# EAGLE board 56 ch sample-and-hold card v1.0 (EAGLE 9.6.2)
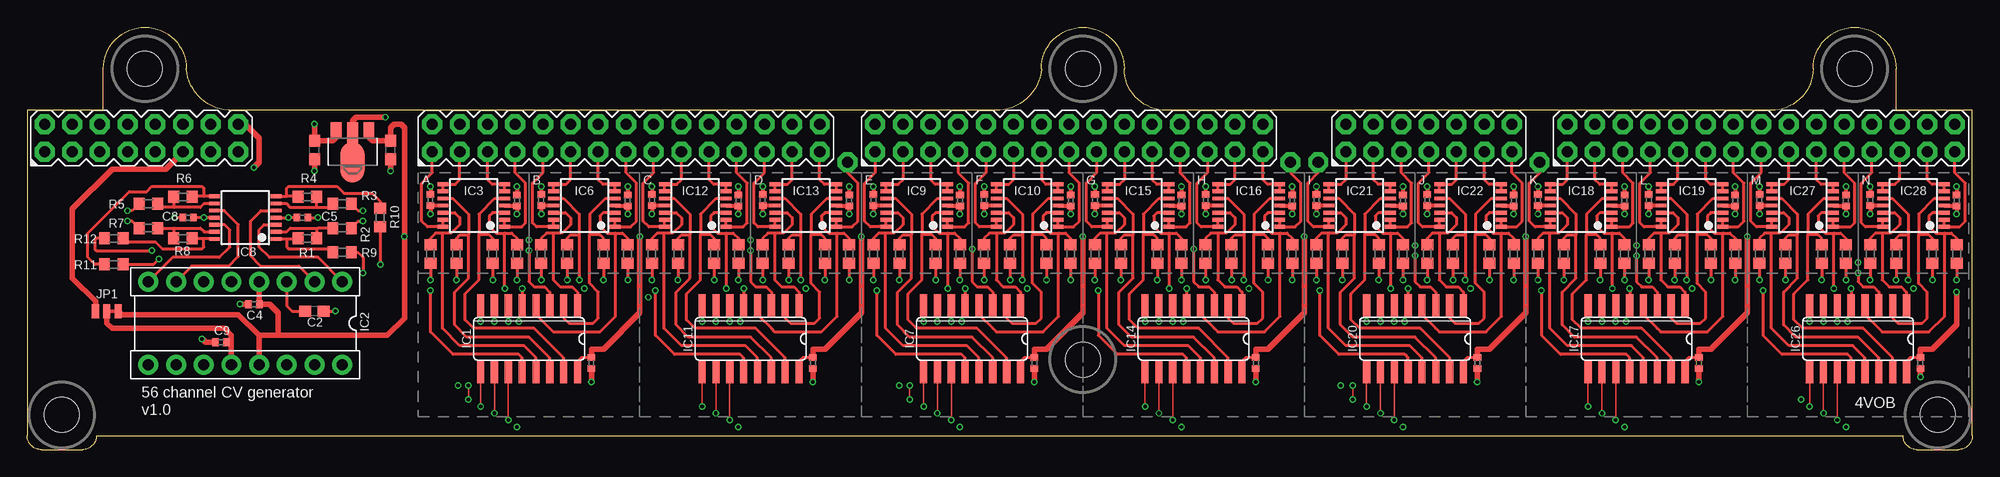
[diagram p3: board, top side]
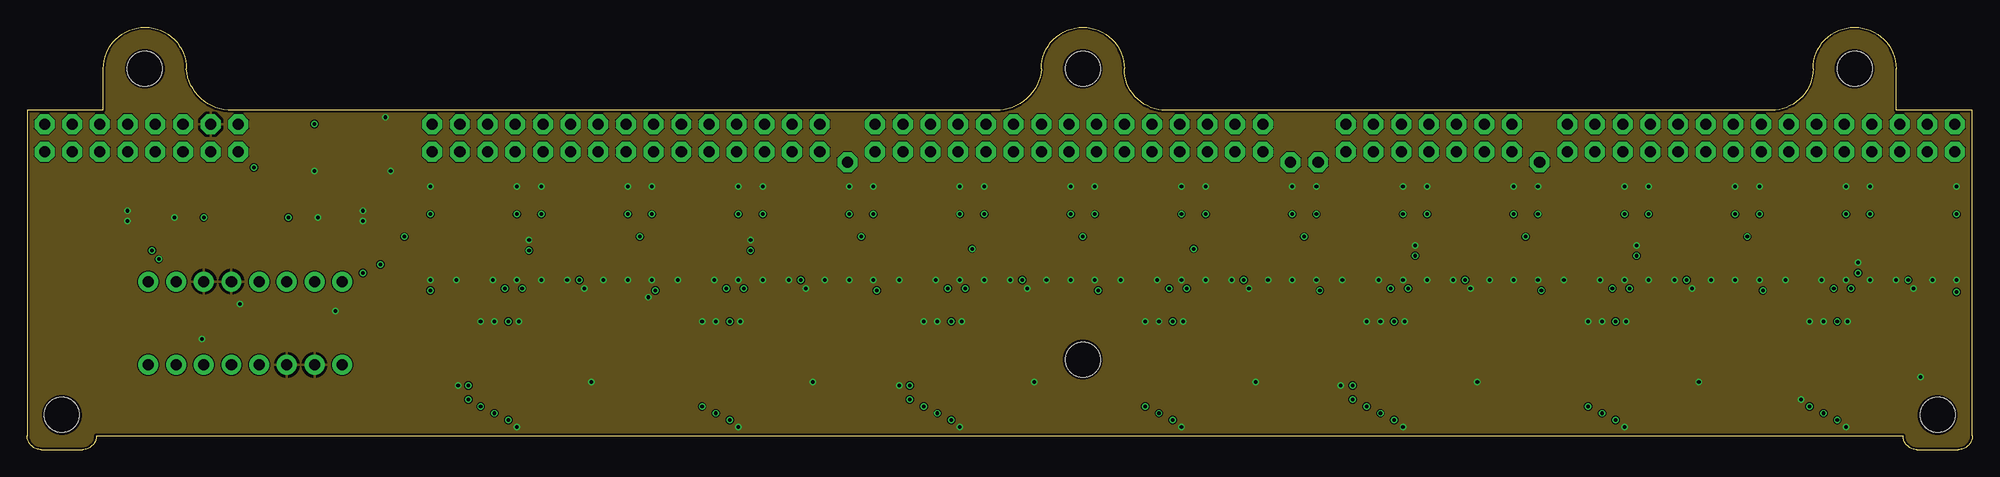
[diagram p4: board, inner layer Route2]
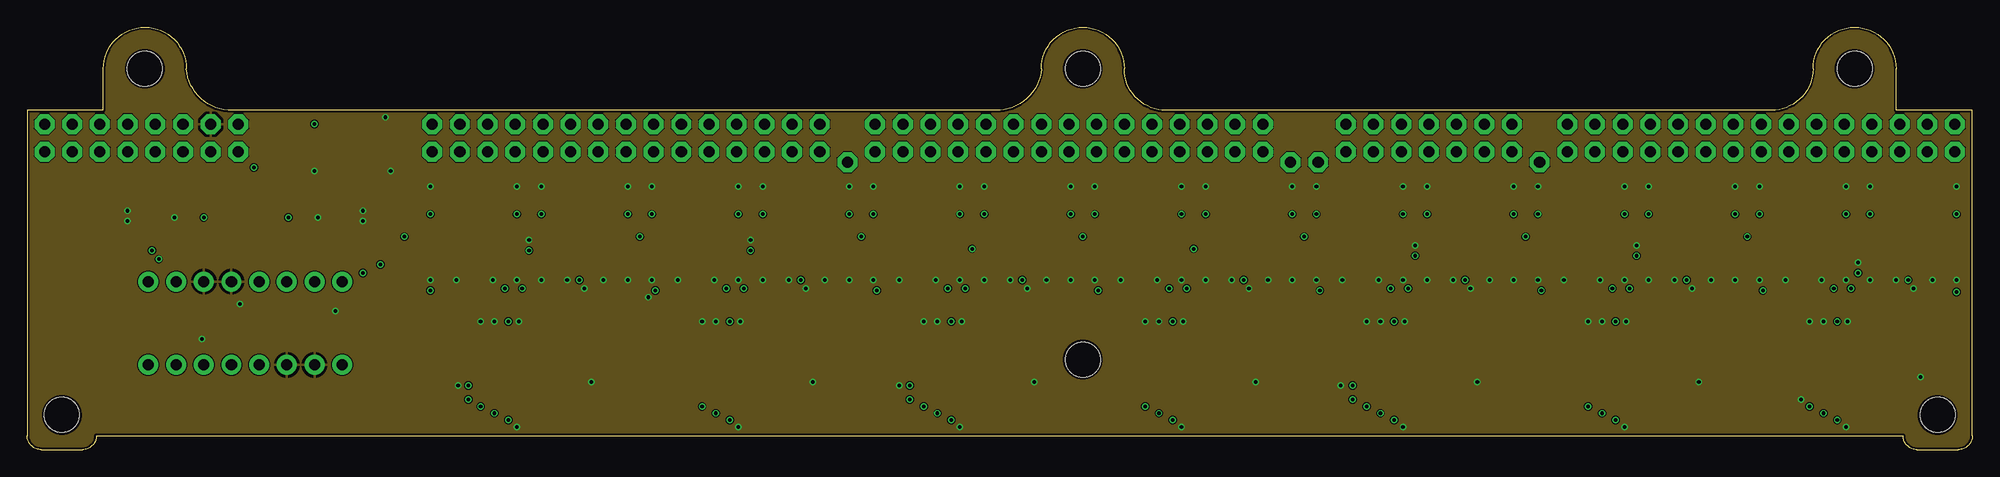
[diagram p5: board, inner layer Route15]
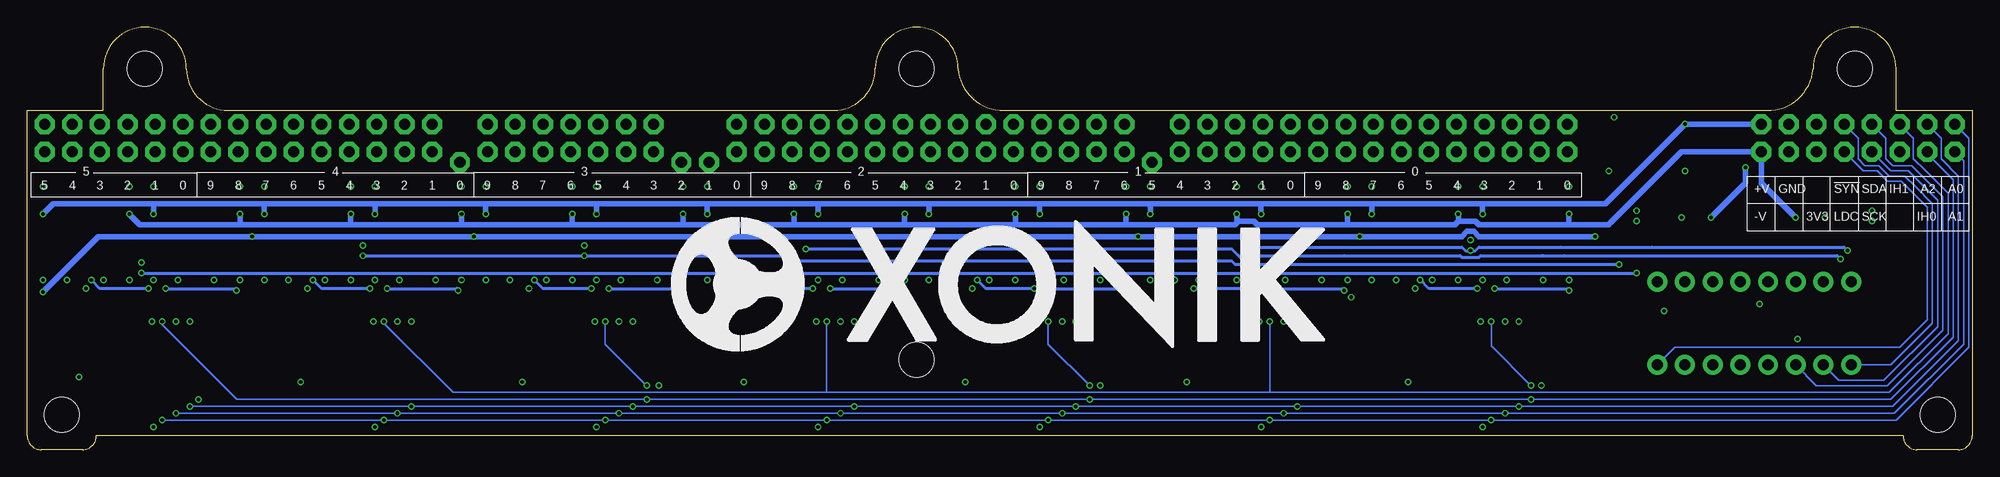
[diagram p6: board, bottom side, seen from below]

Size 178.44 x 38.74 mm. Coordinates in mm from the lower left corner, seen from the top.
Outline: 178.44,14.29 178.44,14.61
Outline: 178.44,14.61 178.44,31.11 171.45,31.11 171.45,34.93 arc180 163.83,34.93 arc-90 160.02,31.11 104.46,31.11 arc-90 100.65,34.93 arc180 93.03,34.93 arc-81 89.22,31.11 18.41,31.11 arc-81 14.61,34.93 arc180 6.99,34.93 6.99,31.11 0,31.11 0,1.27 arc90 1.27,0 5.08,0 arc90 6.35,1.27 172.09,1.27 arc90 173.35,0 177.16,0 arc90 178.44,1.27 178.44,14.61
Copper layers (1+2*15+16): Top 0.035mm / dielectric 0.2mm / Route2 0.0175mm / dielectric 1.065mm / Route15 0.0175mm / dielectric 0.2mm / Bottom 0.035mm
Design rules "jlcpcb-4layers": minimum track width 3.5mil, minimum drill 0.2mm, track to track 3.5mil, track to pad 5mil, pad to pad 5mil, via to via 5mil, smd to smd 5mil, copper to edge 0.2mm, drill to drill 6mil, minimum pad ring 10mil, minimum via ring 0.13mm, stop-mask expansion 0.05mm, vias tented up to drill 16mil, thermal gap 10mil
Holes 3.2 mm at 3.17,3.17 175.26,3.17 96.84,8.26 96.84,34.93 167.64,34.93 10.79,34.93

## Footprints (pad centres in the part's own frame; a part is rotated, then mirrored left to right if it is on the bottom)
C0603 = smd 1.1 x 1: 1 -0.85,0; 2 0.85,0
C0402-J = smd 0.6 x 0.7: 1 -0.5,0; 2 0.5,0
C0603-J = smd 1 x 1.1: 1 -0.85,0; 2 0.85,0
SO16 = smd 0.66 x 2.032: 1 -4.445,-3.073; 2 -3.175,-3.073; 3 -1.905,-3.073; 4 -0.635,-3.073; 5 0.635,-3.073; 6 1.905,-3.073; 7 3.175,-3.073; 8 4.445,-3.073; 9 4.445,3.073; 10 3.175,3.073; 11 1.905,3.073; 12 0.635,3.073; 13 -0.635,3.073; 14 -1.905,3.073; 15 -3.175,3.073; 16 -4.445,3.073
DIL16-FM-CON = drill 1.016: 1 -8.89,-3.81; 2 -6.35,-3.81; 3 -3.81,-3.81; 4 -1.27,-3.81; 5 1.27,-3.81; 6 3.81,-3.81; 7 6.35,-3.81; 8 8.89,-3.81; 9 8.89,3.81; 10 6.35,3.81; 11 3.81,3.81; 12 1.27,3.81; 13 -1.27,3.81; 14 -3.81,3.81; 15 -6.35,3.81; 16 -8.89,3.81
TSSOP14J = smd 0.35 x 1: 1 -1.95,-2.825; 2 -1.3,-2.825; 3 -0.65,-2.825; 4 0,-2.825; 5 0.65,-2.825; 6 1.3,-2.825; 7 1.95,-2.825; 8 1.95,2.825; 9 1.3,2.825; 10 0.65,2.825; 11 0,2.825; 12 -0.65,2.825; 13 -1.3,2.825; 14 -1.95,2.825
SOT89 = smd 1 x 1.5: 1 -1.499,-1.981; 3 1.499,-1.981 | smd 1 x 2: 2 0,-1.727 | smd 2.2 x 3.7: 2@1 0,0.94
SMT-JUMPER_3_1-NC_TRACE_NO-SILK = smd 0.66 x 1.27: 1 -1.041,0; 2 0,0; 3 1.041,0
R0603 = smd 1 x 1.1: 1 -0.85,0; 2 0.85,0
MA15-2J = drill 1.016 octagon: 1 -17.78,-1.27; 2 -17.78,1.27; 3 -15.24,-1.27; 4 -15.24,1.27; 5 -12.7,-1.27; 6 -12.7,1.27; 7 -10.16,-1.27; 8 -10.16,1.27; 9 -7.62,-1.27; 10 -7.62,1.27; 11 -5.08,-1.27; 12 -5.08,1.27; 13 -2.54,-1.27; 14 -2.54,1.27; 15 0,-1.27; 16 0,1.27; 17 2.54,-1.27; 18 2.54,1.27; 19 5.08,-1.27; 20 5.08,1.27; 21 7.62,-1.27; 22 7.62,1.27; 23 10.16,-1.27; 24 10.16,1.27; 25 12.7,-1.27; 26 12.7,1.27; 27 15.24,-1.27; 28 15.24,1.27; 29 17.78,-1.27; 30 17.78,1.27
MA01N-1J = drill 1.016 octagon: 1 0,0
MA08-2J = drill 1.016 octagon: 1 -8.89,-1.27; 2 -8.89,1.27; 3 -6.35,-1.27; 4 -6.35,1.27; 5 -3.81,-1.27; 6 -3.81,1.27; 7 -1.27,-1.27; 8 -1.27,1.27; 9 1.27,-1.27; 10 1.27,1.27; 11 3.81,-1.27; 12 3.81,1.27; 13 6.35,-1.27; 14 6.35,1.27; 15 8.89,-1.27; 16 8.89,1.27
MA02N-1J = drill 1.016 octagon: 1 -2.54,0; 2 0,0
MA07-2J = drill 1.016 octagon: 1 -7.62,-1.27; 2 -7.62,1.27; 3 -5.08,-1.27; 4 -5.08,1.27; 5 -2.54,-1.27; 6 -2.54,1.27; 7 0,-1.27; 8 0,1.27; 9 2.54,-1.27; 10 2.54,1.27; 11 5.08,-1.27; 12 5.08,1.27; 13 7.62,-1.27; 14 7.62,1.27

## Placement (x,y rotation side)
C1  0.1uF  [C0603]  33.34,27.46 90 top
C2  100nF  [C0603]  26.35,12.7 180 top
C3  0.33uF  [C0603]  26.35,27.46 90 top
C4  1uF  [C0402-J]  20.8,13.33 180 top
C5  1uF  [C0402-J]  25.24,21.27 0 top
C6  0.1uF  [C0402-J]  51.75,7.94 90 top
C7  1nF  [C0603-J]  44.93,17.94 90 top
C8  1uF  [C0402-J]  14.76,21.27 0 top
C9  1uF  [C0402-J]  17.78,9.84 180 top
C11  1nF  [C0603-J]  42.7,17.94 90 top
C12  1nF  [C0603-J]  39.37,17.94 90 top
C13  1nF  [C0603-J]  36.99,17.94 90 top
C14  1uF  [C0402-J]  44.93,22.86 90 top
C15  1uF  [C0402-J]  36.99,22.88 270 top
C16  1nF  [C0603-J]  55.09,17.94 90 top
C17  1nF  [C0603-J]  52.86,17.94 90 top
C18  1nF  [C0603-J]  49.53,17.94 90 top
C25  1nF  [C0603-J]  47.15,17.94 90 top
C26  1uF  [C0402-J]  55.09,22.86 90 top
C27  1uF  [C0402-J]  47.15,22.88 270 top
C28  0.1uF  [C0402-J]  92.39,7.94 90 top
C29  1nF  [C0603-J]  85.57,17.94 90 top
C30  1nF  [C0603-J]  83.34,17.94 90 top
C31  1nF  [C0603-J]  80.01,17.94 90 top
C32  1nF  [C0603-J]  77.63,17.94 90 top
C33  1uF  [C0402-J]  85.57,22.86 90 top
C34  1uF  [C0402-J]  77.63,22.88 270 top
C35  1nF  [C0603-J]  95.73,17.94 90 top
C36  1nF  [C0603-J]  93.5,17.94 90 top
C37  1nF  [C0603-J]  90.17,17.94 90 top
C38  1nF  [C0603-J]  87.79,17.94 90 top
C39  1uF  [C0402-J]  95.73,22.86 90 top
C41  1uF  [C0402-J]  87.79,22.88 270 top
C42  0.1uF  [C0402-J]  72.07,7.94 90 top
C43  1nF  [C0603-J]  65.25,17.94 90 top
C44  1nF  [C0603-J]  63.02,17.94 90 top
C45  1nF  [C0603-J]  59.69,17.94 90 top
C46  1nF  [C0603-J]  57.31,17.94 90 top
C47  1uF  [C0402-J]  65.25,22.86 90 top
C48  1uF  [C0402-J]  57.31,22.88 270 top
C49  1nF  [C0603-J]  75.41,17.94 90 top
C50  1nF  [C0603-J]  73.18,17.94 90 top
C51  1nF  [C0603-J]  69.85,17.94 90 top
C52  1nF  [C0603-J]  67.47,17.94 90 top
C53  1uF  [C0402-J]  75.41,22.86 90 top
C54  1uF  [C0402-J]  67.47,22.88 270 top
C55  0.1uF  [C0402-J]  112.71,7.94 90 top
C56  1nF  [C0603-J]  105.89,17.94 90 top
C57  1nF  [C0603-J]  103.66,17.94 90 top
C58  1nF  [C0603-J]  100.33,17.94 90 top
C59  1nF  [C0603-J]  97.95,17.94 90 top
C60  1uF  [C0402-J]  105.89,22.86 90 top
C61  1uF  [C0402-J]  97.95,22.88 270 top
C62  1nF  [C0603-J]  116.05,17.94 90 top
C63  1nF  [C0603-J]  113.82,17.94 90 top
C64  1nF  [C0603-J]  110.49,17.94 90 top
C65  1nF  [C0603-J]  108.11,17.94 90 top
C66  1uF  [C0402-J]  116.05,22.86 90 top
C67  1uF  [C0402-J]  108.11,22.88 270 top
C68  0.1uF  [C0402-J]  153.35,7.94 90 top
C69  1nF  [C0603-J]  146.53,17.94 90 top
C70  1nF  [C0603-J]  144.3,17.94 90 top
C71  1nF  [C0603-J]  140.97,17.94 90 top
C72  1nF  [C0603-J]  138.59,17.94 90 top
C73  1uF  [C0402-J]  146.53,22.86 90 top
C74  1uF  [C0402-J]  138.59,22.88 270 top
C75  1nF  [C0603-J]  156.69,17.94 90 top
C76  1nF  [C0603-J]  154.46,17.94 90 top
C77  1nF  [C0603-J]  151.13,17.94 90 top
C78  1nF  [C0603-J]  148.75,17.94 90 top
C79  1uF  [C0402-J]  156.69,22.86 90 top
C80  1uF  [C0402-J]  148.75,22.88 270 top
C81  0.1uF  [C0402-J]  133.03,7.94 90 top
C82  1nF  [C0603-J]  126.21,17.94 90 top
C83  1nF  [C0603-J]  123.98,17.94 90 top
C84  1nF  [C0603-J]  120.65,17.94 90 top
C85  1nF  [C0603-J]  118.27,17.94 90 top
C86  1uF  [C0402-J]  126.21,22.86 90 top
C87  1uF  [C0402-J]  118.27,22.88 270 top
C88  1nF  [C0603-J]  136.37,17.94 90 top
C89  1nF  [C0603-J]  134.14,17.94 90 top
C90  1nF  [C0603-J]  130.81,17.94 90 top
C91  1nF  [C0603-J]  128.43,17.94 90 top
C92  1uF  [C0402-J]  136.37,22.86 90 top
C93  1uF  [C0402-J]  128.43,22.88 270 top
C107  0.1uF  [C0402-J]  173.67,7.94 90 top
C108  1nF  [C0603-J]  166.85,17.94 90 top
C109  1nF  [C0603-J]  164.62,17.94 90 top
C110  1nF  [C0603-J]  161.29,17.94 90 top
C111  1nF  [C0603-J]  158.91,17.94 90 top
C112  1uF  [C0402-J]  166.85,22.86 90 top
C113  1uF  [C0402-J]  158.91,22.88 270 top
C114  1nF  [C0603-J]  177.01,17.94 90 top
C115  1nF  [C0603-J]  174.78,17.94 90 top
C116  1nF  [C0603-J]  171.45,17.94 90 top
C117  1nF  [C0603-J]  169.07,17.94 90 top
C118  1uF  [C0402-J]  177.01,22.86 90 top
C119  1uF  [C0402-J]  169.07,22.88 270 top
IC1  74HCT4051D  [SO16]  46.04,10.16 180 top
IC2  DAC8565F  [DIL16-FM-CON]  20,11.59 180 top
IC3  TL074JT  [TSSOP14J]  40.96,22.38 90 top
IC5  78L05F  [SOT89]  29.84,27.3 180 top
IC6  TL074JT  [TSSOP14J]  51.12,22.38 90 top
IC7  74HCT4051D  [SO16]  86.68,10.16 180 top
IC8  TL074JT  [TSSOP14J]  20,21.27 90 top
IC9  TL074JT  [TSSOP14J]  81.6,22.38 90 top
IC10  TL074JT  [TSSOP14J]  91.76,22.38 90 top
IC11  74HCT4051D  [SO16]  66.36,10.16 180 top
IC12  TL074JT  [TSSOP14J]  61.28,22.38 90 top
IC13  TL074JT  [TSSOP14J]  71.44,22.38 90 top
IC14  74HCT4051D  [SO16]  107,10.16 180 top
IC15  TL074JT  [TSSOP14J]  101.92,22.38 90 top
IC16  TL074JT  [TSSOP14J]  112.08,22.38 90 top
IC17  74HCT4051D  [SO16]  147.64,10.16 180 top
IC18  TL074JT  [TSSOP14J]  142.56,22.38 90 top
IC19  TL074JT  [TSSOP14J]  152.72,22.38 90 top
IC20  74HCT4051D  [SO16]  127.32,10.16 180 top
IC21  TL074JT  [TSSOP14J]  122.24,22.38 90 top
IC22  TL074JT  [TSSOP14J]  132.4,22.38 90 top
IC26  74HCT4051D  [SO16]  167.96,10.16 180 top
IC27  TL074JT  [TSSOP14J]  162.88,22.38 90 top
IC28  TL074JT  [TSSOP14J]  173.04,22.38 90 top
JP1  JUMPER-SMT_3_1-NC_TRACE_NO-SILK_DNM  [SMT-JUMPER_3_1-NC_TRACE_NO-SILK]  7.3,12.7 0 top
R1  10k  [R0603]  25.72,19.37 180 top
R2  10k  [R0603]  28.89,20.32 180 top
R3  10k  [R0603]  28.89,22.54 180 top
R4  10k  [R0603]  25.72,23.18 180 top
R5  10k  [R0603]  11.11,22.54 0 top
R6  10k  [R0603]  14.29,23.18 0 top
R7  10k  [R0603]  11.11,20.32 0 top
R8  10k  [R0603]  14.29,19.37 0 top
R9  220R  [R0603]  28.89,18.1 0 top
R10  220R  [R0603]  32.38,21.27 270 top
R11  220R  [R0603]  7.94,16.99 0 top
R12  220R  [R0603]  7.94,19.37 180 top
U$1  [XONIK_LOGO_60]  119.38,9.05 0 bottom
U$2  MA15-2J-FEMALE  [MA15-2J]  54.93,28.57 0 top
U$3  MA15-2J-FEMALE  [MA15-2J]  95.57,28.57 0 top
U$4  MA15-2J-FEMALE  [MA15-2J]  159.07,28.57 0 top
X4  DNM  [MA01N-1J]  138.75,26.35 0 top
X5  DNM  [MA01N-1J]  75.25,26.35 0 top
X6  MA08-2J-FEMALE  [MA08-2J]  10.48,28.57 0 top
X9  DNM  [MA02N-1J]  118.43,26.35 0 top
X10  MA07-2J-FEMALE  [MA07-2J]  128.59,28.57 0 top

## Tracks (layer width: path | path; a pad name or v marks a point on that pad's centre or on a via)
5V_REF
  Top 0.254: IC2.3 23.81,13.18 24.29,12.7 C2.2
!SYNC
  Bottom 0.13: IC2.9 7.46,7.78 3.65,11.59 3.65,22.54 5.24,24.13 6.19,25.08 7.62,25.08 8.57,26.04 9.84,26.04 10.48,26.67 10.48,28.57 X6.10
+3V3
  Top 0.508: X6.11 12.7,25.72 7.78,25.72 4.13,22.07 4.13,15.72 6.26,13.58 JP1.1
+5V  (via drill 0.33)
  Top 0.254: C6.2 51.73,8.41 50.8,8.41 50.48,8.1 IC1.16 | C42.2 72.05,8.41 71.12,8.41 70.8,8.1 IC11.16 | C28.2 92.37,8.41 91.44,8.41 91.12,8.1 IC7.16 | C55.2 112.69,8.41 111.76,8.41 111.44,8.1 IC14.16 | C81.2 133.01,8.41 132.08,8.41 131.76,8.1 IC20.16 | C68.2 153.33,8.41 152.4,8.41 152.08,8.1 IC17.16 | C107.2 173.65,8.41 172.72,8.41 172.4,8.1 IC26.16
  Top 0.508: C6.2 51.75,9.21 52.86,9.21 56.2,12.54 v56.2,19.53 | C42.2 72.07,9.21 73.18,9.21 76.52,12.54 v76.52,19.53 | C28.2 92.39,9.21 93.5,9.21 96.84,12.54 v96.84,19.53 | C55.2 112.71,9.21 113.82,9.21 117.16,12.54 v117.16,19.53 | C81.2 133.03,9.21 134.14,9.21 137.48,12.54 v137.48,19.53 | C68.2 153.35,9.21 154.46,9.21 157.8,12.54 v157.8,19.53 | C107.2 173.67,9.21 174.78,9.21 177.01,11.43 v177.01,14.45 | IC5.1 31.34,28.66 31.69,28.31 C1.2 33.34,29.53 33.66,29.84 34.29,29.84 34.61,29.53 v34.61,19.53 34.61,12.06 33.02,10.48 23.02,10.48 | IC2.4 21.3,15.38 C4.1 22.23,13.33 23.02,12.54 23.02,10.48 | 23.02,10.48 21.27,10.48 | 21.27,10.48 19.37,12.38 8.66,12.38 JP1.3 | IC2.13 21.27,10.48
  Bottom 0.508: v177.01,14.45 171.93,19.53 v157.8,19.53 v137.48,19.53 v117.16,19.53 v96.84,19.53 v76.52,19.53 67.15,19.53 66.67,20 66.04,20 65.56,19.53 v56.2,19.53 46.83,19.53 46.35,20 45.72,20 45.24,19.53 v34.61,19.53
+12V  (via drill 0.33)
  Top 0.254: C5.1 v23.97,21.27 IC8.4
  Top 0.356: IC3.4 44.9,22.38 C14.1 v44.93,21.59 | IC6.4 55.06,22.38 C26.1 v55.09,21.59 | IC12.4 65.22,22.38 C47.1 v65.25,21.59 | IC13.4 75.38,22.38 C53.1 v75.41,21.59 | IC9.4 85.54,22.38 C33.1 v85.57,21.59 | IC10.4 95.7,22.38 C39.1 v95.73,21.59 | IC15.4 105.86,22.38 C60.1 v105.89,21.59 | IC16.4 116.02,22.38 C66.1 v116.05,21.59 | IC21.4 126.18,22.38 C86.1 v126.21,21.59 | IC22.4 136.34,22.38 C92.1 v136.37,21.59 | IC18.4 146.5,22.38 C73.1 v146.53,21.59 | IC19.4 156.66,22.38 C79.1 v156.69,21.59 | IC27.4 166.82,22.38 C112.1 v166.85,21.59 | IC28.4 176.98,22.38 C118.1 v177.01,21.59
  Top 0.508: IC5.3 28.35,28.66 28,28.31 C3.2 v26.35,29.84 | X6.16 20,29.84 21.27,28.57 21.27,26.35 v20.8,25.88
  Bottom 0.508: 55.09,21.75 v55.09,21.59 55.09,22.54 | 44.93,21.75 v44.93,21.59 44.93,22.54 | 75.41,21.75 v75.41,21.59 75.41,22.38 75.56,22.54 | 65.25,21.75 v65.25,21.59 65.25,22.54 | 95.73,21.75 v95.73,21.59 95.73,22.54 | 85.57,21.75 v85.57,21.59 85.57,22.38 85.72,22.54 | 116.05,21.75 v116.05,21.59 116.05,22.54 | 105.89,21.75 v105.89,21.59 105.89,22.54 | 136.37,21.75 v136.37,21.59 136.37,22.54 | 126.21,21.75 v126.21,21.59 126.21,22.54 | 156.69,21.75 v156.69,21.59 156.69,22.54 | 146.53,21.75 v146.53,21.59 146.53,22.38 146.69,22.54 | 166.85,21.75 v166.85,21.59 166.85,22.54 | X6.16 v26.35,29.84 33.66,22.54 44.93,22.54 | v177.01,21.59 176.05,22.54 166.85,22.54 | 55.09,22.54 65.25,22.54 | 65.25,22.54 75.56,22.54 | 75.56,22.54 85.72,22.54 | 85.72,22.54 95.73,22.54 | 95.73,22.54 105.89,22.54 | 105.89,22.54 116.05,22.54 | 116.05,22.54 126.21,22.54 | 126.21,22.54 136.37,22.54 | 136.37,22.54 146.69,22.54 | 146.69,22.54 156.69,22.54 | 156.69,22.54 166.85,22.54 | 55.09,22.54 44.93,22.54 | v20.8,25.88 20.8,24.45 v23.97,21.27
-12V  (via drill 0.33)
  Top 0.254: C8.2 v16.19,21.27 IC8.11
  Top 0.356: IC3.11 C15.2 v36.99,21.59 | IC6.11 C27.2 v47.15,21.59 | IC12.11 C48.2 v57.31,21.59 | IC13.11 C54.2 v67.47,21.59 | IC9.11 C34.2 v77.63,21.59 | IC10.11 C41.2 v87.79,21.59 | IC15.11 C61.2 v97.95,21.59 | IC16.11 C67.2 v108.11,21.59 | IC21.11 C87.2 v118.27,21.59 | IC22.11 C93.2 v128.43,21.59 | IC18.11 C74.2 v138.59,21.59 | IC19.11 C80.2 v148.75,21.59 | IC27.11 C113.2 v158.91,21.59 | IC28.11 C119.2 v169.07,21.59
  Bottom 0.508: v36.99,21.59 36.99,20.64 39.21,20.64 | v47.15,21.59 47.15,20.95 | 39.21,20.64 33.34,20.64 33.18,20.8 26.67,27.3 X6.15 19.37,24.45 v16.19,21.27 | 39.21,20.64 39.37,20.64 45.24,20.64 45.56,20.95 47.15,20.95 | v57.31,21.59 57.31,20.64 | v67.47,21.59 67.47,20.95 | 67.47,20.95 67.47,20.8 67.63,20.64 77.63,20.64 | 57.31,20.64 49.69,20.64 47.47,20.64 47.15,20.95 | 57.31,20.64 59.53,20.64 59.69,20.64 65.56,20.64 65.88,20.95 67.47,20.95 | v77.63,21.59 77.63,20.64 | v87.79,21.59 87.79,20.64 | 77.63,20.64 79.85,20.64 80.01,20.64 87.63,20.64 87.79,20.64 | v97.95,21.59 97.95,20.64 | v108.11,21.59 108.11,20.64 | 97.95,20.64 90.33,20.64 87.79,20.64 | 97.95,20.64 100.17,20.64 100.33,20.64 107.95,20.64 108.11,20.64 | v118.27,21.59 118.27,20.64 | v128.43,21.59 128.43,20.64 | 118.27,20.64 110.65,20.64 108.11,20.64 | 118.27,20.64 120.49,20.64 120.65,20.64 128.27,20.64 128.43,20.64 | v138.59,21.59 138.59,20.64 | v148.75,21.59 148.75,20.64 | 138.59,20.64 130.97,20.64 128.43,20.64 | 138.59,20.64 140.81,20.64 140.97,20.64 148.59,20.64 148.75,20.64 | v158.91,21.59 158.91,20.64 | v169.07,21.59 168.12,20.64 158.91,20.64 | 158.91,20.64 151.29,20.64 148.75,20.64
A0  (via drill 0.33)
  Top 0.13: IC1.11 v44.13,2.7 | v166.05,2.7 IC26.11 | IC17.11 v145.73,2.7 | IC14.11 v105.09,2.7 | IC7.11 v84.77,2.7 | IC11.11 v64.45,2.7 | IC20.11 v125.41,2.7
  Bottom 0.13: 64.14,2.7 v44.13,2.7 6.99,2.7 0.32,9.37 0.32,28.57 X6.2 | 64.14,2.7 v64.45,2.7 | v64.45,2.7 84.45,2.7 | 84.45,2.7 v84.77,2.7 | v84.77,2.7 v105.09,2.7 125.09,2.7 | 125.09,2.7 v125.41,2.7 | v125.41,2.7 145.41,2.7 | 145.41,2.7 v145.73,2.7 | v145.73,2.7 v166.05,2.7 | 145.41,2.7 v145.73,2.7 | 125.09,2.7 v125.41,2.7 | 84.45,2.7 v84.77,2.7 | 64.14,2.7 v64.45,2.7
A1  (via drill 0.33)
  Top 0.13: IC26.10 v164.78,3.33 | v42.86,3.33 IC1.10 | IC17.10 v144.46,3.33 | IC14.10 v103.82,3.33 | IC7.10 v83.5,3.33 | IC11.10 v63.18,3.33 | IC20.10 v124.14,3.33
  Bottom 0.13: v164.78,3.33 v144.46,3.33 | v144.46,3.33 144.15,3.33 | 144.15,3.33 v124.14,3.33 | v124.14,3.33 123.83,3.33 | 123.83,3.33 v103.82,3.33 | v103.82,3.33 95.89,3.33 | 95.89,3.33 76.36,3.33 | 76.36,3.33 v83.5,3.33 | v83.5,3.33 v63.18,3.33 | v63.18,3.33 62.71,3.33 | 62.71,3.33 v42.86,3.33 28.26,3.33 7.14,3.33 0.79,9.68 0.79,26.51 X6.1 | v144.46,3.33 144.15,3.33 | v124.14,3.33 123.83,3.33 | v103.82,3.33 95.89,3.33 | 76.36,3.33 v83.5,3.33 | v63.18,3.33 62.71,3.33
A2  (via drill 0.33)
  Top 0.13: IC1.9 v41.59,3.97 | IC26.9 v163.51,3.97 | IC17.9 v143.19,3.97 | v122.87,3.97 122.87,5.4 | 122.87,5.4 IC20.9 122.87,5.4 | IC14.9 v102.55,3.97 | IC7.9 v82.23,3.97 | IC11.9 v61.91,3.97
  Bottom 0.13: v163.51,3.97 v143.19,3.97 | v143.19,3.97 143.03,3.97 | 143.03,3.97 v122.87,3.97 | v122.87,3.97 122.56,3.97 | 122.56,3.97 v102.55,3.97 | v102.55,3.97 94.77,3.97 | 94.77,3.97 74.93,3.97 | 74.93,3.97 v82.23,3.97 | v82.23,3.97 62.39,3.97 | 62.39,3.97 v61.91,3.97 | v61.91,3.97 v41.59,3.97 28.1,3.97 7.3,3.97 1.27,10 1.27,25.08 2.86,26.67 2.86,28.57 X6.4 | v143.19,3.97 143.03,3.97 | v122.87,3.97 122.56,3.97 | v102.55,3.97 94.77,3.97 | 74.93,3.97 v82.23,3.97 | 62.39,3.97 v61.91,3.97
AGND  (via drill 0.33)
  Top 0.254: C13.1 v36.99,15.56 | C12.1 v39.37,15.56 | C11.1 v42.7,15.56 | C7.1 v44.93,15.56 | C25.1 v47.15,15.56 | C18.1 v49.53,15.56 | C17.1 v52.86,15.56 | C16.1 v55.09,15.56 | IC1.8 v41.59,11.75 | IC1.7 v42.86,11.75 | C46.1 v57.31,15.56 | C45.1 v59.69,15.56 | C44.1 v63.02,15.56 | C43.1 v65.25,15.56 | C52.1 v67.47,15.56 | C51.1 v69.85,15.56 | C50.1 v73.18,15.56 | C49.1 v75.41,15.56 | IC11.8 v61.91,11.75 | IC11.7 v63.18,11.75 | C32.1 v77.63,15.56 | C31.1 v80.01,15.56 | C30.1 v83.34,15.56 | C29.1 v85.57,15.56 | C38.1 v87.79,15.56 | C37.1 v90.17,15.56 | C36.1 v93.5,15.56 | C35.1 v95.73,15.56 | IC7.8 v82.23,11.75 | IC7.7 v83.5,11.75 | C59.1 v97.95,15.56 | C58.1 v100.33,15.56 | C57.1 v103.66,15.56 | C56.1 v105.89,15.56 | C65.1 v108.11,15.56 | C64.1 v110.49,15.56 | C63.1 v113.82,15.56 | C62.1 v116.05,15.56 | IC14.8 v102.55,11.75 | IC14.7 v103.82,11.75 | C85.1 v118.27,15.56 | C84.1 v120.65,15.56 | C83.1 v123.98,15.56 | C82.1 v126.21,15.56 | C91.1 v128.43,15.56 | C90.1 v130.81,15.56 | C89.1 v134.14,15.56 | C88.1 v136.37,15.56 | IC20.8 v122.87,11.75 | IC20.7 v124.14,11.75 | C72.1 v138.59,15.56 | C71.1 v140.97,15.56 | C70.1 v144.3,15.56 | C69.1 v146.53,15.56 | C78.1 v148.75,15.56 | C77.1 v151.13,15.56 | C76.1 v154.46,15.56 | C75.1 v156.69,15.56 | IC17.8 v143.19,11.75 | IC17.7 v144.46,11.75 | C111.1 v158.91,15.56 | C110.1 v161.29,15.56 | C109.1 v164.62,15.56 | C108.1 v166.85,15.56 | C117.1 v169.07,15.56 | C116.1 v171.45,15.56 | C115.1 v174.78,15.56 | C114.1 v177.01,15.56 | IC26.8 v163.51,11.75 | IC26.7 v164.78,11.75 | C2.1 v28.26,12.7 | R5.1 9.63,21.91 v9.21,21.91 | R7.1 9.63,20.95 v9.21,20.95 | R3.1 30.38,21.91 v30.8,21.91 | R2.1 30.38,20.95 v30.8,20.95 | C5.2 v26.67,21.27 | C8.1 v13.49,21.27 | IC5.2 IC5.2@1
  Top 0.356: v36.99,24.13 C15.1 | v44.93,24.13 C14.2 | v47.15,24.13 C27.1 | v55.09,24.13 C26.2 | v57.31,24.13 C48.1 | v65.25,24.13 C47.2 | v67.47,24.13 C54.1 | v75.41,24.13 C53.2 | v77.63,24.13 C34.1 | v85.57,24.13 C33.2 | v87.79,24.13 C41.1 | v95.73,24.13 C39.2 | v97.95,24.13 C61.1 | v105.89,24.13 C60.2 | v108.11,24.13 C67.1 | v116.05,24.13 C66.2 | v118.27,24.13 C87.1 | v126.21,24.13 C86.2 | v128.43,24.13 C93.1 | v136.37,24.13 C92.2 | v138.59,24.13 C74.1 | v146.53,24.13 C73.2 | v148.75,24.13 C80.1 | v156.69,24.13 C79.2 | v158.91,24.13 C113.1 | v166.85,24.13 C112.2 | v169.07,24.13 C119.1 | v177.01,24.13 C118.2
  Top 0.508: C6.1 v51.75,6.19 | C42.1 v72.07,6.19 | C28.1 v92.39,6.19 | C55.1 v112.71,6.19 | C81.1 v133.03,6.19 | C68.1 v153.35,6.19 | C107.1 v173.67,6.67 | C3.1 v26.35,25.56 | C1.1 v33.34,25.56 | IC5.2 29.84,30.14 30.18,30.48 v32.86,30.48 | C4.2 v19.53,13.33 | C9.2 16.35,9.84 v16.03,10.16
  other vias: 39.53,5.87 44.93,2.06 65.25,2.06 85.57,2.06 105.89,2.06 126.21,2.06 146.53,2.06 166.85,2.06 127.32,18.73 147.64,18.73 167.96,17.14 66.36,19.21 46.04,19.21 51.12,14.76 71.44,14.76 91.76,14.76 112.08,14.76 132.4,14.76 152.72,14.76 173.04,14.76 56.99,13.97 45.09,11.75 65.41,11.75 85.72,11.75 106.05,11.75 126.36,11.75 146.69,11.75 167,11.75 80.01,5.87 120.49,5.87 162.72,4.6
  pour Route2: -1.27,41.28 179.71,41.28 179.71,0 -1.27,0
  pour Route15: -2.54,42.55 180.97,42.55 180.97,-0.64 -2.54,-0.64
DAC_1  (via drill 0.33)
  Top 0.254: v167.96,16.19 167.96,15.4 168.43,14.92 169.39,14.92 169.86,14.45 IC26.3 | R9.2 30.32,18.1 30.8,17.62 v30.8,16.19
  Bottom 0.254: v167.96,16.19 v30.8,16.19
DAC_2  (via drill 0.33)
  Top 0.254: v127.32,17.78 127.32,15.4 127.79,14.92 128.75,14.92 129.22,14.45 IC20.3 | v147.64,17.78 147.64,15.4 148.11,14.92 149.07,14.92 149.54,14.45 IC17.3 | R10.2 32.38,17.04 32.41,17.01 v32.38,16.99
  Bottom 0.254: v147.64,17.78 v127.32,17.78 108.11,17.78 107.63,17.3 67.94,17.3 67.63,16.99 35.72,16.99 | 35.72,16.99 35.56,16.99 | 35.72,16.99 v32.38,16.99
DAC_3  (via drill 0.33)
  Top 0.254: v86.68,18.41 86.68,15.4 87.15,14.92 88.11,14.92 88.58,14.45 IC7.3 | v107,18.41 107,15.4 107.47,14.92 108.43,14.92 108.9,14.45 IC14.3 | R11.2 11.59,16.99 v12.06,17.46
  Bottom 0.254: v107,18.41 v86.68,18.41 77.95,18.41 67.94,18.41 67.31,17.78 67.15,17.62 65.56,17.62 65.41,17.78 57.63,17.78 46.99,17.78 46.83,17.62 45.24,17.62 45.09,17.78 39.53,17.78 39.37,17.78 37.47,17.78 12.38,17.78 v12.06,17.46
DAC_4  (via drill 0.33)
  Top 0.254: v46.04,18.26 46.04,15.4 46.51,14.92 47.47,14.92 47.94,14.45 IC1.3 | v66.36,18.26 66.36,15.4 66.83,14.92 67.79,14.92 68.26,14.45 IC11.3 | R12.2 6.35,19.37 6.19,19.21 6.19,18.41 6.35,18.26 v11.43,18.26
  Bottom 0.254: v66.36,18.26 65.88,18.26 65.56,18.57 46.83,18.57 46.51,18.26 v46.04,18.26 45.56,18.26 45.24,18.57 37.78,18.57 29.37,18.57 11.75,18.57 v11.43,18.26
DAC_BUF_1
  Top 0.254: IC8.1 23.81,19.32 | 23.81,19.32 24.82,19.32 R1.2 | 23.81,19.32 23.81,18.57 23.97,18.41 27.73,18.41 R9.1
DAC_BUF_2
  Top 0.254: IC8.7 23.81,23.22 | 23.81,23.22 24.82,23.22 R4.2 | 23.81,23.22 23.81,23.97 23.97,24.13 28.42,24.13 29.05,23.5 31.65,23.5 32.38,22.76 R10.1
DAC_BUF_3
  Top 0.254: IC8.8 16.19,23.22 | 16.19,23.22 15.18,23.22 R6.2 | 16.19,23.22 16.19,23.97 16.03,24.13 11.43,24.13 10.95,23.65 9.37,23.65 5.56,19.84 5.56,17.62 6.19,16.99 R11.1
DAC_BUF_4
  Top 0.254: IC8.14 16.19,19.32 | 16.19,19.32 15.18,19.32 R8.2 | R12.1 9.11,19.05 11.75,19.05 12.38,18.41 16.03,18.41 16.19,18.57 16.19,19.32
DAC_RAW_1
  Top 0.254: IC8.3 21.73,20.62 21.27,20.16 21.27,18.57 22.23,17.62 26.67,17.62 IC2.1
DAC_RAW_2
  Top 0.254: IC8.5 21.45,21.92 20.48,20.95 20.48,17.78 21.43,16.83 24.92,16.83 IC2.2
DAC_RAW_3
  Top 0.254: IC8.10 18.08,21.92 19.37,20.64 19.37,17.72 18.48,16.83 15.08,16.83 IC2.7
DAC_RAW_4
  Top 0.254: IC8.12 17.19,20.64 18.1,20.64 18.57,20.16 18.57,18.57 17.62,17.62 13.34,17.62 IC2.8
IN_0
  Top 0.254: IC3.12 39.23,21.73 39.69,21.27 39.69,20.64 38.89,19.84 38.73,19.84 38.1,19.84 | C13.2 36.99,19.37 37.47,19.84 38.1,19.84 | IC1.13 46.67,8.41 45.56,9.53 39.69,9.53 38.1,11.11 38.1,19.84
IN_1
  Top 0.254: IC3.10 39.04,23.03 40.48,21.59 40.48,19.68 | 40.48,19.68 40.48,15.72 39.21,14.45 39.21,11.43 40.32,10.32 46.04,10.32 47.94,8.41 IC1.14 | C12.2 39.37,19.37 39.69,19.68 40.48,19.68
IN_2
  Top 0.254: 41.43,19.84 41.43,21.59 42.88,23.03 IC3.5 | 41.43,19.84 41.43,19.74 | 41.43,19.84 41.43,19.68 | 41.43,19.68 41.43,15.56 40.16,14.29 40.16,11.91 40.96,11.11 46.51,11.11 49.21,8.41 IC1.15 | C11.2 42.7,19.37 42.39,19.68 41.43,19.68
IN_3  (via drill 0.33)
  Top 0.254: C7.2 44.93,19.37 44.45,19.84 43.81,19.84 | IC3.3 42.69,21.73 42.39,21.43 42.39,20.48 43.02,19.84 43.81,19.84 | v43.81,14.76 43.81,19.84 | IC1.12 45.4,8.41 45.09,8.73 39.05,8.73 36.99,10.79 v36.99,14.61
  Bottom 0.254: v43.81,14.76 37.15,14.76 v36.99,14.61
IN_4
  Top 0.254: IC6.12 49.39,21.73 49.85,21.27 49.85,20.64 49.05,19.84 48.9,19.84 48.26,19.84 | C25.2 47.15,19.37 47.62,19.84 48.26,19.84 | 48.26,19.84 48.26,15.56 48.9,14.92 50.01,14.92 50.48,14.45 IC1.1
IN_5  (via drill 0.33)
  Top 0.254: IC6.10 49.2,23.03 50.64,21.59 50.64,19.68 | C18.2 49.53,19.37 49.85,19.68 50.64,19.68 | v45.4,14.76 IC1.5 | 50.64,19.68 50.64,16.03 v50.64,15.56
  Bottom 0.254: v50.64,15.56 49.85,14.76 v45.4,14.76
IN_6
  Top 0.254: 51.59,19.84 51.59,21.59 53.04,23.03 IC6.5 | 51.59,19.84 51.59,19.74 | 51.59,19.84 51.59,19.68 | 51.59,19.68 51.59,15.24 52.39,14.45 52.39,12.06 51.91,11.59 49.69,11.59 49.21,12.06 IC1.2 | C17.2 52.86,19.37 52.55,19.68 51.59,19.68
IN_7
  Top 0.254: C16.2 55.09,19.37 54.61,19.84 53.98,19.84 | IC6.3 52.85,21.73 52.55,21.43 52.55,20.48 53.18,19.84 53.98,19.84 | IC1.4 46.67,12.38 47.94,11.11 48.26,10.79 52.55,10.79 53.98,12.22 53.98,19.84
IN_8
  Top 0.254: IC12.12 59.55,21.73 60.01,21.27 60.01,20.64 59.21,19.84 59.05,19.84 58.42,19.84 | C46.2 57.31,19.37 57.78,19.84 58.42,19.84 | IC11.13 66.99,8.41 65.88,9.53 60.01,9.53 58.42,11.11 58.42,19.84
IN_9
  Top 0.254: IC12.10 59.36,23.03 60.8,21.59 60.8,19.68 | 60.8,19.68 60.8,15.72 59.53,14.45 59.53,11.43 60.64,10.32 66.36,10.32 68.26,8.41 IC11.14 | C45.2 59.69,19.37 60.01,19.68 60.8,19.68
IN_10
  Top 0.254: 61.75,19.84 61.75,21.59 63.2,23.03 IC12.5 | 61.75,19.84 61.75,19.74 | 61.75,19.84 61.75,19.68 | 61.75,19.68 61.75,15.56 60.48,14.29 60.48,11.91 61.28,11.11 66.83,11.11 69.53,8.41 IC11.15 | C44.2 63.02,19.37 62.71,19.68 61.75,19.68
IN_11  (via drill 0.33)
  Top 0.254: C43.2 65.25,19.37 64.77,19.84 64.14,19.84 | IC12.3 63.01,21.73 62.71,21.43 62.71,20.48 63.34,19.84 64.14,19.84 | v64.14,14.76 64.14,19.84 | IC11.12 65.72,8.41 65.41,8.73 59.37,8.73 57.63,10.48 v57.63,14.61
  Bottom 0.254: v64.14,14.76 57.78,14.76 v57.63,14.61
IN_12
  Top 0.254: IC13.12 69.71,21.73 70.17,21.27 70.17,20.64 69.37,19.84 69.22,19.84 68.58,19.84 | C52.2 67.47,19.37 67.94,19.84 68.58,19.84 | 68.58,19.84 68.58,15.56 69.22,14.92 70.33,14.92 70.8,14.45 IC11.1
IN_13  (via drill 0.33)
  Top 0.254: IC13.10 69.52,23.03 70.96,21.59 70.96,19.68 | C51.2 69.85,19.37 70.17,19.68 70.96,19.68 | v65.72,14.76 IC11.5 | 70.96,19.68 70.96,16.03 v70.96,15.56
  Bottom 0.254: v70.96,15.56 70.17,14.76 v65.72,14.76
IN_14
  Top 0.254: 71.91,19.84 71.91,21.59 73.36,23.03 IC13.5 | 71.91,19.84 71.91,19.74 | 71.91,19.84 71.91,19.68 | 71.91,19.68 71.91,15.24 72.71,14.45 72.71,12.06 72.23,11.59 70.01,11.59 69.53,12.06 IC11.2 | C50.2 73.18,19.37 72.87,19.68 71.91,19.68
IN_15
  Top 0.254: C49.2 75.41,19.37 74.93,19.84 74.3,19.84 | IC13.3 73.17,21.73 72.87,21.43 72.87,20.48 73.5,19.84 74.3,19.84 | IC11.4 66.99,12.38 68.26,11.11 68.58,10.79 72.87,10.79 74.3,12.22 74.3,19.84
IN_16
  Top 0.254: IC9.12 79.87,21.73 80.33,21.27 80.33,20.64 79.53,19.84 79.38,19.84 78.74,19.84 | C32.2 77.63,19.37 78.11,19.84 78.74,19.84 | IC7.13 87.31,8.41 86.2,9.53 80.33,9.53 78.74,11.11 78.74,19.84
IN_17
  Top 0.254: IC9.10 79.68,23.03 81.12,21.59 81.12,19.68 | 81.12,19.68 81.12,15.72 79.85,14.45 79.85,11.43 80.96,10.32 86.68,10.32 88.58,8.41 IC7.14 | C31.2 80.01,19.37 80.33,19.68 81.12,19.68
IN_18
  Top 0.254: 82.07,19.84 82.07,21.59 83.52,23.03 IC9.5 | 82.07,19.84 82.07,19.74 | 82.07,19.84 82.07,19.68 | 82.07,19.68 82.07,15.56 80.8,14.29 80.8,11.91 81.6,11.11 87.15,11.11 89.85,8.41 IC7.15 | C30.2 83.34,19.37 83.03,19.68 82.07,19.68
IN_19  (via drill 0.33)
  Top 0.254: C29.2 85.57,19.37 85.09,19.84 84.45,19.84 | IC9.3 83.33,21.73 83.03,21.43 83.03,20.48 83.66,19.84 84.45,19.84 | v84.45,14.76 84.45,19.84 | IC7.12 86.04,8.41 85.72,8.73 79.69,8.73 77.95,10.48 v77.95,14.61
  Bottom 0.254: v84.45,14.76 78.11,14.76 v77.95,14.61
IN_20
  Top 0.254: IC10.12 90.03,21.73 90.49,21.27 90.49,20.64 89.69,19.84 89.53,19.84 88.9,19.84 | C38.2 87.79,19.37 88.27,19.84 88.9,19.84 | 88.9,19.84 88.9,15.56 89.53,14.92 90.65,14.92 91.12,14.45 IC7.1
IN_21  (via drill 0.33)
  Top 0.254: IC10.10 89.84,23.03 91.28,21.59 91.28,19.68 | C37.2 90.17,19.37 90.49,19.68 91.28,19.68 | v86.04,14.76 IC7.5 | 91.28,19.68 91.28,16.03 v91.28,15.56
  Bottom 0.254: v86.04,14.76 90.49,14.76 v91.28,15.56
IN_22
  Top 0.254: 92.23,19.84 92.23,21.59 93.68,23.03 IC10.5 | 92.23,19.84 92.23,19.74 | 92.23,19.84 92.23,19.68 | 92.23,19.68 92.23,15.24 93.03,14.45 93.03,12.06 92.55,11.59 90.33,11.59 89.85,12.06 IC7.2 | C36.2 93.5,19.37 93.19,19.68 92.23,19.68
IN_23
  Top 0.254: C35.2 95.73,19.37 95.25,19.84 94.61,19.84 | IC10.3 93.49,21.73 93.19,21.43 93.19,20.48 93.82,19.84 94.61,19.84 | IC7.4 87.31,12.38 88.58,11.11 88.9,10.79 93.19,10.79 94.61,12.22 94.61,19.84
IN_24
  Top 0.254: IC15.12 100.19,21.73 100.65,21.27 100.65,20.64 99.85,19.84 99.69,19.84 99.06,19.84 | C59.2 97.95,19.37 98.42,19.84 99.06,19.84 | IC14.13 107.63,8.41 106.52,9.53 100.65,9.53 99.06,11.11 99.06,19.84
IN_25
  Top 0.254: IC15.10 100,23.03 101.44,21.59 101.44,19.68 | 101.44,19.68 101.44,15.72 100.17,14.45 100.17,11.43 101.28,10.32 107,10.32 108.9,8.41 IC14.14 | C58.2 100.33,19.37 100.65,19.68 101.44,19.68
IN_26
  Top 0.254: 102.39,19.84 102.39,21.59 103.84,23.03 IC15.5 | 102.39,19.84 102.39,19.74 | 102.39,19.84 102.39,19.68 | 102.39,19.68 102.39,15.56 101.12,14.29 101.12,11.91 101.92,11.11 107.47,11.11 110.17,8.41 IC14.15 | C57.2 103.66,19.37 103.35,19.68 102.39,19.68
IN_27  (via drill 0.33)
  Top 0.254: C56.2 105.89,19.37 105.41,19.84 104.78,19.84 | IC15.3 103.65,21.73 103.35,21.43 103.35,20.48 103.98,19.84 104.78,19.84 | v104.78,14.76 104.78,19.84 | IC14.12 106.36,8.41 106.05,8.73 100.01,8.73 98.27,10.48 v98.27,14.61
  Bottom 0.254: v104.78,14.76 98.42,14.76 v98.27,14.61
IN_28
  Top 0.254: IC16.12 110.35,21.73 110.81,21.27 110.81,20.64 110.01,19.84 109.86,19.84 109.22,19.84 | C65.2 108.11,19.37 108.58,19.84 109.22,19.84 | 109.22,19.84 109.22,15.56 109.86,14.92 110.97,14.92 111.44,14.45 IC14.1
IN_29  (via drill 0.33)
  Top 0.254: IC16.10 110.16,23.03 111.6,21.59 111.6,19.68 | C64.2 110.49,19.37 110.81,19.68 111.6,19.68 | v106.36,14.76 IC14.5 | 111.6,19.68 111.6,16.03 v111.6,15.56
  Bottom 0.254: v111.6,15.56 110.81,14.76 v106.36,14.76
IN_30
  Top 0.254: 112.55,19.84 112.55,21.59 114,23.03 IC16.5 | 112.55,19.84 112.55,19.74 | 112.55,19.84 112.55,19.68 | 112.55,19.68 112.55,15.24 113.35,14.45 113.35,12.06 112.87,11.59 110.65,11.59 110.17,12.06 IC14.2 | C63.2 113.82,19.37 113.51,19.68 112.55,19.68
IN_31
  Top 0.254: C62.2 116.05,19.37 115.57,19.84 114.94,19.84 | IC16.3 113.81,21.73 113.51,21.43 113.51,20.48 114.14,19.84 114.94,19.84 | IC14.4 107.63,12.38 108.9,11.11 109.22,10.79 113.51,10.79 114.94,12.22 114.94,19.84
IN_32
  Top 0.254: IC21.12 120.51,21.73 120.97,21.27 120.97,20.64 120.17,19.84 120.02,19.84 119.38,19.84 | C85.2 118.27,19.37 118.75,19.84 119.38,19.84 | IC20.13 127.95,8.41 126.84,9.53 120.97,9.53 119.38,11.11 119.38,19.84
IN_33
  Top 0.254: IC21.10 120.32,23.03 121.76,21.59 121.76,19.68 | 121.76,19.68 121.76,15.72 120.49,14.45 120.49,11.43 121.6,10.32 127.32,10.32 129.22,8.41 IC20.14 | C84.2 120.65,19.37 120.97,19.68 121.76,19.68
IN_34
  Top 0.254: 122.71,19.84 122.71,21.59 124.16,23.03 IC21.5 | 122.71,19.84 122.71,19.74 | 122.71,19.84 122.71,19.68 | 122.71,19.68 122.71,15.56 121.44,14.29 121.44,11.91 122.24,11.11 127.79,11.11 130.49,8.41 IC20.15 | C83.2 123.98,19.37 123.67,19.68 122.71,19.68
IN_35  (via drill 0.33)
  Top 0.254: C82.2 126.21,19.37 125.73,19.84 125.09,19.84 | IC21.3 123.97,21.73 123.67,21.43 123.67,20.48 124.3,19.84 125.09,19.84 | v125.09,14.76 125.09,19.84 | IC20.12 126.68,8.41 126.36,8.73 120.33,8.73 118.59,10.48 v118.59,14.61
  Bottom 0.254: v125.09,14.76 118.75,14.76 v118.59,14.61
IN_36
  Top 0.254: IC22.12 130.67,21.73 131.13,21.27 131.13,20.64 130.33,19.84 130.18,19.84 129.54,19.84 | C91.2 128.43,19.37 128.91,19.84 129.54,19.84 | 129.54,19.84 129.54,15.56 130.18,14.92 131.29,14.92 131.76,14.45 IC20.1
IN_37  (via drill 0.33)
  Top 0.254: IC22.10 130.48,23.03 131.92,21.59 131.92,19.68 | C90.2 130.81,19.37 131.13,19.68 131.92,19.68 | v126.68,14.76 IC20.5 | 131.92,19.68 131.92,16.03 v131.92,15.56
  Bottom 0.254: v126.68,14.76 131.13,14.76 v131.92,15.56
IN_38
  Top 0.254: 132.87,19.84 132.87,21.59 134.32,23.03 IC22.5 | 132.87,19.84 132.87,19.74 | 132.87,19.84 132.87,19.68 | 132.87,19.68 132.87,15.24 133.67,14.45 133.67,12.06 133.19,11.59 130.97,11.59 130.49,12.06 IC20.2 | C89.2 134.14,19.37 133.83,19.68 132.87,19.68
IN_39
  Top 0.254: C88.2 136.37,19.37 135.89,19.84 135.25,19.84 | IC22.3 134.13,21.73 133.83,21.43 133.83,20.48 134.46,19.84 135.25,19.84 | IC20.4 127.95,12.38 129.22,11.11 129.54,10.79 133.83,10.79 135.25,12.22 135.25,19.84
IN_40
  Top 0.254: IC18.12 140.83,21.73 141.29,21.27 141.29,20.64 140.49,19.84 140.34,19.84 139.7,19.84 | C72.2 138.59,19.37 139.06,19.84 139.7,19.84 | IC17.13 148.27,8.41 147.16,9.53 141.29,9.53 139.7,11.11 139.7,19.84
IN_41
  Top 0.254: IC18.10 140.64,23.03 142.08,21.59 142.08,19.68 | 142.08,19.68 142.08,15.72 140.81,14.45 140.81,11.43 141.92,10.32 147.64,10.32 149.54,8.41 IC17.14 | C71.2 140.97,19.37 141.29,19.68 142.08,19.68
IN_42
  Top 0.254: 143.03,19.84 143.03,21.59 144.48,23.03 IC18.5 | 143.03,19.84 143.03,19.74 | 143.03,19.84 143.03,19.68 | 143.03,19.68 143.03,15.56 141.76,14.29 141.76,11.91 142.56,11.11 148.11,11.11 150.81,8.41 IC17.15 | C70.2 144.3,19.37 143.99,19.68 143.03,19.68
IN_43  (via drill 0.33)
  Top 0.254: C69.2 146.53,19.37 146.05,19.84 145.41,19.84 | IC18.3 144.29,21.73 143.99,21.43 143.99,20.48 144.62,19.84 145.41,19.84 | v145.41,14.76 145.41,19.84 | IC17.12 147,8.41 146.69,8.73 140.65,8.73 138.91,10.48 v138.91,14.61
  Bottom 0.254: v145.41,14.76 139.06,14.76 v138.91,14.61
IN_44
  Top 0.254: IC19.12 150.99,21.73 151.45,21.27 151.45,20.64 150.65,19.84 150.5,19.84 149.86,19.84 | C78.2 148.75,19.37 149.22,19.84 149.86,19.84 | 149.86,19.84 149.86,15.56 150.5,14.92 151.61,14.92 152.08,14.45 IC17.1
IN_45  (via drill 0.33)
  Top 0.254: IC19.10 150.8,23.03 152.24,21.59 152.24,19.68 | C77.2 151.13,19.37 151.45,19.68 152.24,19.68 | v147,14.76 IC17.5 | 152.24,19.68 152.24,16.03 v152.24,15.56
  Bottom 0.254: v147,14.76 151.45,14.76 v152.24,15.56
IN_46
  Top 0.254: 153.19,19.84 153.19,21.59 154.64,23.03 IC19.5 | 153.19,19.84 153.19,19.74 | 153.19,19.84 153.19,19.68 | 153.19,19.68 153.19,15.24 153.99,14.45 153.99,12.06 153.51,11.59 151.29,11.59 150.81,12.06 IC17.2 | C76.2 154.46,19.37 154.15,19.68 153.19,19.68
IN_47
  Top 0.254: C75.2 156.69,19.37 156.21,19.84 155.57,19.84 | IC19.3 154.45,21.73 154.15,21.43 154.15,20.48 154.78,19.84 155.57,19.84 | IC17.4 148.27,12.38 149.54,11.11 149.86,10.79 154.15,10.79 155.57,12.22 155.57,19.84
IN_48
  Top 0.254: IC27.12 161.15,21.73 161.61,21.27 161.61,20.64 160.81,19.84 160.66,19.84 160.02,19.84 | C111.2 158.91,19.37 159.38,19.84 160.02,19.84 | IC26.13 168.59,8.41 167.48,9.53 161.61,9.53 160.02,11.11 160.02,19.84
IN_49
  Top 0.254: IC27.10 160.96,23.03 162.4,21.59 162.4,19.68 | 162.4,19.68 162.4,15.72 161.13,14.45 161.13,11.43 162.24,10.32 167.96,10.32 169.86,8.41 IC26.14 | C110.2 161.29,19.37 161.61,19.68 162.4,19.68
IN_50
  Top 0.254: 163.35,19.84 163.35,21.59 164.8,23.03 IC27.5 | 163.35,19.84 163.35,19.74 | 163.35,19.84 163.35,19.68 | 163.35,19.68 163.35,15.56 162.08,14.29 162.08,11.91 162.88,11.11 168.43,11.11 171.13,8.41 IC26.15 | C109.2 164.62,19.37 164.31,19.68 163.35,19.68
IN_51  (via drill 0.33)
  Top 0.254: C108.2 166.85,19.37 166.37,19.84 165.74,19.84 | IC27.3 164.61,21.73 164.31,21.43 164.31,20.48 164.94,19.84 165.74,19.84 | v165.74,14.76 165.74,19.84 | IC26.12 167.32,8.41 167,8.73 160.97,8.73 159.23,10.48 v159.23,14.61
  Bottom 0.254: v165.74,14.76 159.38,14.76 v159.23,14.61
IN_52
  Top 0.254: IC28.12 171.31,21.73 171.77,21.27 171.77,20.64 170.97,19.84 170.81,19.84 170.18,19.84 | C117.2 169.07,19.37 169.54,19.84 170.18,19.84 | 170.18,19.84 170.18,15.56 170.81,14.92 171.93,14.92 172.4,14.45 IC26.1
IN_53  (via drill 0.33)
  Top 0.254: IC28.10 171.12,23.03 172.56,21.59 172.56,19.68 | C116.2 171.45,19.37 171.77,19.68 172.56,19.68 | v167.32,14.76 IC26.5 | 172.56,19.68 172.56,16.03 v172.56,15.56
  Bottom 0.254: v167.32,14.76 171.77,14.76 v172.56,15.56
IN_54
  Top 0.254: 173.51,19.84 173.51,21.59 174.96,23.03 IC28.5 | 173.51,19.84 173.51,19.74 | 173.51,19.84 173.51,19.68 | 173.51,19.68 173.51,15.24 174.31,14.45 174.31,12.06 173.83,11.59 171.61,11.59 171.13,12.06 IC26.2 | C115.2 174.78,19.37 174.47,19.68 173.51,19.68
IN_55
  Top 0.254: C114.2 177.01,19.37 176.53,19.84 175.9,19.84 | IC28.3 174.77,21.73 174.47,21.43 174.47,20.48 175.1,19.84 175.9,19.84 | IC26.4 168.59,12.38 169.86,11.11 170.18,10.79 174.47,10.79 175.9,12.22 175.9,19.84
INH_0  (via drill 0.33)
  Top 0.13: IC1.6 v44.13,11.75 | IC7.6 v84.77,11.75 | IC20.6 v125.41,11.75 | IC26.6 v166.05,11.75 | v40.48,5.87 v40.48,4.6 | v80.96,5.87 v80.96,4.6 | v121.6,5.87 v121.6,4.6
  Bottom 0.13: v44.13,11.75 44.13,9.53 v40.48,5.87 | v84.77,11.75 84.77,9.68 v80.96,5.87 | v125.41,11.75 125.41,9.68 v121.6,5.87 | v166.05,11.75 166.05,11.43 159.23,4.6 114.46,4.6 | 114.46,4.6 v121.6,4.6 | v121.6,4.6 v80.96,4.6 v40.48,4.6 27.78,4.6 7.46,4.6 1.75,10.32 1.75,24.77 4.13,27.15 X6.3 | 114.46,4.6 v121.6,4.6
INH_1  (via drill 0.33)
  Top 0.13: IC11.6 v64.45,11.75 | IC14.6 v105.09,11.75 | IC17.6 v145.73,11.75
  Bottom 0.13: v145.73,11.75 145.73,11.59 139.38,5.24 105.09,5.24 | 105.09,5.24 93.98,5.24 64.45,5.24 | 64.45,5.24 56.83,5.24 27.62,5.24 7.62,5.24 2.22,10.64 2.22,23.5 4.29,25.56 5.4,26.67 5.4,28.57 X6.6 | 64.45,5.24 v64.45,11.75 | v105.09,11.75 105.09,5.24
LDAC
  Bottom 0.13: IC2.16 27.3,9.37 6.67,9.37 4.13,11.91 4.13,22.22 4.92,23.02 6.51,24.61 7.78,24.61 8.73,25.56 10,25.56 X6.9
N$1
  Top 0.508: JP1.2 7.3,11.59 7.78,11.11 18.1,11.11 18.73,10.48 18.73,9.84 | 18.73,9.84 18.73,9.53 IC2.12 | C9.1 18.73,9.84
N$2
  Top 0.254: IC8.2 23.78,19.97 24.13,20.32 26.67,20.32 | R2.2 26.67,20.32 | 26.67,20.32 26.57,20.22 R1.1
N$3
  Top 0.254: IC8.6 23.78,22.57 24.13,22.22 26.51,22.22 | R3.2 27.73,22.22 26.51,22.22 | 26.51,22.22 26.57,22.28 R4.1
N$4
  Top 0.254: IC8.9 17.15,22.54 16.19,22.54 15.88,22.22 13.49,22.22 | 13.49,22.22 12.28,22.22 R5.2 | R6.1 13.44,22.28 13.49,22.22
N$5
  Top 0.254: R7.2 13.49,20.32 | 13.49,20.32 15.88,20.32 16.22,19.97 IC8.13 | 13.49,20.32 13.44,20.26 R8.1
OUT_0
  Top 0.254: IC3.14 IC3.13 | IC3.14 38.13,21.07 38.18,21.11 | IC3.14 36.72,20.43 36.2,20.95 36.2,24.45 37.15,25.4 U$2.1
OUT_1
  Top 0.254: IC3.9 IC3.8 39.26,24.33 39.69,24.77 U$2.3
OUT_2
  Top 0.254: IC3.6 IC3.7 42.66,24.33 42.23,24.77 U$2.5
OUT_3
  Top 0.254: IC3.1 IC3.2 | IC3.1 43.78,21.07 43.74,21.11 | IC3.1 45.36,20.43 45.72,20.8 45.72,24.45 44.77,25.4 U$2.7
OUT_4
  Top 0.254: IC6.14 IC6.13 | IC6.14 48.29,21.07 48.34,21.11 | IC6.14 46.72,20.43 46.35,20.8 46.35,24.45 47.31,25.4 U$2.9
OUT_5
  Top 0.254: IC6.9 IC6.8 49.42,24.33 49.85,24.77 U$2.11
OUT_6
  Top 0.254: IC6.6 IC6.7 52.82,24.33 52.39,24.77 U$2.13
OUT_7
  Top 0.254: IC6.1 IC6.2 | IC6.1 53.94,21.07 53.9,21.11 | IC6.1 55.36,20.43 55.88,20.95 55.88,24.45 54.93,25.4 U$2.15
OUT_8
  Top 0.254: IC12.14 IC12.13 | IC12.14 58.45,21.07 58.5,21.11 | IC12.14 57.04,20.43 56.52,20.95 56.52,24.45 57.47,25.4 U$2.17
OUT_9
  Top 0.254: IC12.9 IC12.8 59.58,24.33 60.01,24.77 U$2.19
OUT_10
  Top 0.254: IC12.6 IC12.7 62.98,24.33 62.55,24.77 U$2.21
OUT_11
  Top 0.254: IC12.1 IC12.2 | IC12.1 64.1,21.07 64.06,21.11 | IC12.1 65.68,20.43 66.04,20.8 66.04,24.45 65.09,25.4 U$2.23
OUT_12
  Top 0.254: IC13.14 IC13.13 | IC13.14 68.61,21.07 68.66,21.11 | IC13.14 67.04,20.43 66.67,20.8 66.67,24.45 67.63,25.4 U$2.25
OUT_13
  Top 0.254: IC13.9 IC13.8 69.74,24.33 70.17,24.77 U$2.27
OUT_14
  Top 0.254: IC13.6 IC13.7 73.14,24.33 72.71,24.77 U$2.29
OUT_15
  Top 0.254: IC13.1 IC13.2 | IC13.1 74.26,21.07 74.22,21.11 | IC13.1 75.68,20.43 76.2,20.95 76.2,24.45 75.25,25.4 X5.1
OUT_16
  Top 0.254: IC9.14 IC9.13 | IC9.14 78.77,21.07 78.82,21.11 | IC9.14 77.36,20.43 76.83,20.95 76.83,24.45 77.79,25.4 U$3.1
OUT_17
  Top 0.254: IC9.9 IC9.8 79.9,24.33 80.33,24.77 U$3.3
OUT_18
  Top 0.254: IC9.6 IC9.7 83.3,24.33 82.87,24.77 U$3.5
OUT_19
  Top 0.254: IC9.1 IC9.2 | IC9.1 84.42,21.07 84.38,21.11 | IC9.1 86,20.43 86.36,20.8 86.36,24.45 85.41,25.4 U$3.7
OUT_20
  Top 0.254: IC10.14 IC10.13 | IC10.14 88.93,21.07 88.98,21.11 | IC10.14 87.36,20.43 87,20.8 87,24.45 87.95,25.4 U$3.9
OUT_21
  Top 0.254: IC10.9 IC10.8 90.06,24.33 90.49,24.77 U$3.11
OUT_22
  Top 0.254: IC10.6 IC10.7 93.46,24.33 93.03,24.77 U$3.13
OUT_23
  Top 0.254: IC10.1 IC10.2 | IC10.1 94.58,21.07 94.54,21.11 | IC10.1 96,20.43 96.52,20.95 96.52,24.45 95.57,25.4 U$3.15
OUT_24
  Top 0.254: IC15.14 IC15.13 | IC15.14 99.09,21.07 99.14,21.11 | IC15.14 97.68,20.43 97.16,20.95 97.16,24.45 98.11,25.4 U$3.17
OUT_25
  Top 0.254: IC15.9 IC15.8 100.22,24.33 100.65,24.77 U$3.19
OUT_26
  Top 0.254: IC15.6 IC15.7 103.62,24.33 103.19,24.77 U$3.21
OUT_27
  Top 0.254: IC15.1 IC15.2 | IC15.1 104.74,21.07 104.7,21.11 | IC15.1 106.32,20.43 106.68,20.8 106.68,24.45 105.73,25.4 U$3.23
OUT_28
  Top 0.254: IC16.14 IC16.13 | IC16.14 109.25,21.07 109.3,21.11 | IC16.14 107.68,20.43 107.31,20.8 107.31,24.45 108.27,25.4 U$3.25
OUT_29
  Top 0.254: IC16.9 IC16.8 110.38,24.33 110.81,24.77 U$3.27
OUT_30
  Top 0.254: IC16.6 IC16.7 113.78,24.33 113.35,24.77 U$3.29
OUT_31
  Top 0.254: IC16.1 IC16.2 | IC16.1 114.9,21.07 114.86,21.11 | IC16.1 116.32,20.43 116.84,20.95 116.84,24.45 115.89,25.4 X9.1
OUT_32
  Top 0.254: IC21.14 IC21.13 | IC21.14 119.41,21.07 119.46,21.11 | IC21.14 118,20.43 117.47,20.95 117.47,24.45 118.43,25.4 X9.2
OUT_33
  Top 0.254: IC21.9 IC21.8 120.54,24.33 120.97,24.77 X10.1
OUT_34
  Top 0.254: IC21.6 IC21.7 123.94,24.33 123.51,24.77 X10.3
OUT_35
  Top 0.254: IC21.1 IC21.2 | IC21.1 125.06,21.07 125.02,21.11 | IC21.1 126.64,20.43 127,20.8 127,24.45 126.05,25.4 X10.5
OUT_36
  Top 0.254: IC22.14 IC22.13 | IC22.14 129.57,21.07 129.62,21.11 | IC22.14 128,20.43 127.64,20.8 127.64,24.45 128.59,25.4 X10.7
OUT_37
  Top 0.254: IC22.9 IC22.8 130.7,24.33 131.13,24.77 X10.9
OUT_38
  Top 0.254: IC22.6 IC22.7 134.1,24.33 133.67,24.77 X10.11
OUT_39
  Top 0.254: IC22.1 IC22.2 | IC22.1 135.22,21.07 135.18,21.11 | IC22.1 136.64,20.43 137.16,20.95 137.16,24.45 136.21,25.4 X10.13
OUT_40
  Top 0.254: IC18.14 IC18.13 | IC18.14 139.73,21.07 139.78,21.11 | IC18.14 138.32,20.43 137.79,20.95 137.79,24.45 138.75,25.4 X4.1
OUT_41
  Top 0.254: IC18.9 IC18.8 140.86,24.33 141.29,24.77 U$4.1
OUT_42
  Top 0.254: IC18.6 IC18.7 144.26,24.33 143.83,24.77 U$4.3
OUT_43
  Top 0.254: IC18.1 IC18.2 | IC18.1 145.38,21.07 145.34,21.11 | IC18.1 146.96,20.43 147.32,20.8 147.32,24.45 146.37,25.4 U$4.5
OUT_44
  Top 0.254: IC19.14 IC19.13 | IC19.14 149.89,21.07 149.94,21.11 | IC19.14 148.32,20.43 147.96,20.8 147.96,24.45 148.91,25.4 U$4.7
OUT_45
  Top 0.254: IC19.9 IC19.8 151.02,24.33 151.45,24.77 U$4.9
OUT_46
  Top 0.254: IC19.6 IC19.7 154.42,24.33 153.99,24.77 U$4.11
OUT_47
  Top 0.254: IC19.1 IC19.2 | IC19.1 155.54,21.07 155.5,21.11 | IC19.1 156.96,20.43 157.48,20.95 157.48,24.45 156.53,25.4 U$4.13
OUT_48
  Top 0.254: IC27.14 IC27.13 | IC27.14 160.05,21.07 160.1,21.11 | IC27.14 158.64,20.43 158.12,20.95 158.12,24.45 159.07,25.4 U$4.15
OUT_49
  Top 0.254: IC27.9 IC27.8 161.18,24.33 161.61,24.77 U$4.17
OUT_50
  Top 0.254: IC27.6 IC27.7 164.58,24.33 164.15,24.77 U$4.19
OUT_51
  Top 0.254: IC27.1 IC27.2 | IC27.1 165.7,21.07 165.66,21.11 | IC27.1 167.28,20.43 167.64,20.8 167.64,24.45 166.69,25.4 U$4.21
OUT_52
  Top 0.254: IC28.14 IC28.13 | IC28.14 170.21,21.07 170.26,21.11 | IC28.14 168.64,20.43 168.28,20.8 168.28,24.45 169.23,25.4 U$4.23
OUT_53
  Top 0.254: IC28.9 IC28.8 171.34,24.33 171.77,24.77 U$4.25
OUT_54
  Top 0.254: IC28.6 IC28.7 174.74,24.33 174.31,24.77 U$4.27
OUT_55
  Top 0.254: IC28.1 IC28.2 | IC28.1 175.86,21.07 175.82,21.11 | IC28.1 177.28,20.43 177.8,20.95 177.8,24.45 176.85,25.4 U$4.29
SCK
  Bottom 0.13: IC2.10 12.22,6.35 8.1,6.35 3.17,11.27 3.17,22.86 5.87,25.56 7.46,25.56 X6.7
SDA
  Bottom 0.13: IC2.11 14.29,5.87 7.78,5.87 2.7,10.95 2.7,23.18 5.56,26.04 7.3,26.04 7.94,26.67 7.94,28.57 X6.8

## Text on the board
tNames: A | B | C | D | E | F | G | H | I | J | K | L | M | N | 56 channel CV generator | 4VOB | v1.0
bNames: 0 | 1 | 2 | 3 | 4 | 5 | 0 | 1 | 2 | 3 | 4 | 5 | 6 | 7 | 8 | 9 | 0 | 1 | 2 | 3 | 4 | 5 | 6 | 7 | 8 | 9 | 0 | 1 | 2 | 3 | 4 | 5 | 6 | 7 | 8 | 9 | 0 | 1 | 2 | 3 | 4 | 5 | 6 | 7 | 8 | 9 | 0 | 1 | 2 | 3 | 4 | 5 | 6 | 7 | 8 | 9 | 0 | 1 | 2 | 3 | 4 | 5 | A0 | A2 | IH1 | SDA | !SYN | GND | +V | A1 | IH0 | SCK | LDC | 3V3 | -V
Document: TODO: REAR ROW IS NOT CONNECTED!